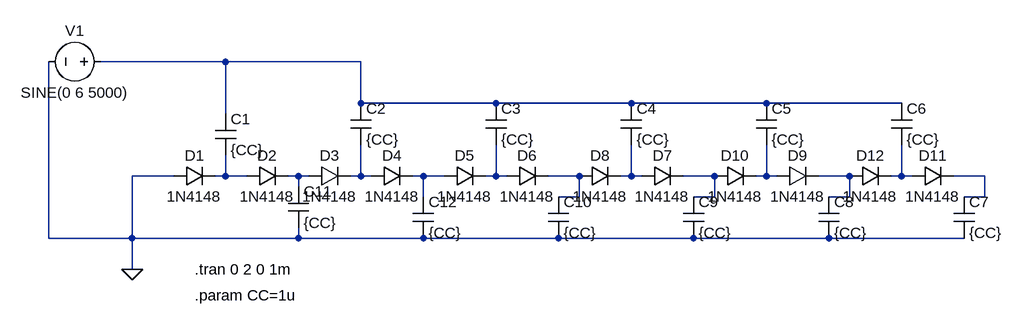
[diagram p0: schematic voltage-multiplier.asc]
voltage-multiplier.asc, the LTspice schematic file:
Version 4
SHEET 1 2364 1048
WIRE 160 80 -32 80
WIRE 368 80 160 80
WIRE 368 144 368 80
WIRE 576 144 368 144
WIRE 784 144 576 144
WIRE 992 144 784 144
WIRE 1200 144 992 144
WIRE 160 160 160 80
WIRE 80 256 16 256
WIRE 160 256 160 224
WIRE 160 256 144 256
WIRE 192 256 160 256
WIRE 272 256 256 256
WIRE 288 256 272 256
WIRE 368 256 368 208
WIRE 368 256 352 256
WIRE 384 256 368 256
WIRE 464 256 448 256
WIRE 496 256 464 256
WIRE 576 256 576 208
WIRE 576 256 560 256
WIRE 592 256 576 256
WIRE 704 256 656 256
WIRE 784 256 784 208
WIRE 784 256 768 256
WIRE 800 256 784 256
WIRE 912 256 864 256
WIRE 992 256 992 208
WIRE 992 256 976 256
WIRE 1008 256 992 256
WIRE 1120 256 1072 256
WIRE 1200 256 1200 208
WIRE 1200 256 1184 256
WIRE 1216 256 1200 256
WIRE 1328 256 1280 256
WIRE 272 272 272 256
WIRE 464 288 464 256
WIRE 704 288 704 256
WIRE 704 288 672 288
WIRE 912 288 912 256
WIRE 912 288 880 288
WIRE 1120 288 1120 256
WIRE 1120 288 1088 288
WIRE 1328 288 1328 256
WIRE 1328 288 1296 288
WIRE -112 352 -112 80
WIRE 16 352 16 256
WIRE 16 352 -112 352
WIRE 272 352 272 336
WIRE 272 352 16 352
WIRE 464 352 272 352
WIRE 672 352 464 352
WIRE 880 352 672 352
WIRE 1088 352 880 352
WIRE 1296 352 1088 352
WIRE 16 400 16 352
FLAG 16 400 0
SYMBOL diode 80 272 R270
WINDOW 0 32 32 VTop 2
WINDOW 3 0 32 VBottom 2
SYMATTR InstName D1
SYMATTR Value 1N4148
SYMBOL cap 144 160 R0
SYMATTR InstName C1
SYMATTR Value {CC}
SYMATTR SpiceLine V=X Rser=1m Lser=0 mfg="   ---" pn="   ---" type="   ---"
SYMBOL Voltage -16 80 R90
WINDOW 0 -32 56 VBottom 2
WINDOW 3 32 56 VTop 2
SYMATTR InstName V1
SYMATTR Value SINE(0 6 5000)
SYMATTR Value2 AC 0
SYMATTR SpiceLine Rser=50
SYMBOL diode 192 272 R270
WINDOW 0 32 32 VTop 2
WINDOW 3 0 32 VBottom 2
SYMATTR InstName D2
SYMATTR Value 1N4148
SYMBOL diode 288 272 R270
WINDOW 0 32 32 VTop 2
WINDOW 3 0 32 VBottom 2
SYMATTR InstName D3
SYMATTR Value 1N4148
SYMBOL diode 384 272 R270
WINDOW 0 32 32 VTop 2
WINDOW 3 0 32 VBottom 2
SYMATTR InstName D4
SYMATTR Value 1N4148
SYMBOL diode 592 272 R270
WINDOW 0 32 32 VTop 2
WINDOW 3 0 32 VBottom 2
SYMATTR InstName D6
SYMATTR Value 1N4148
SYMBOL diode 496 272 R270
WINDOW 0 32 32 VTop 2
WINDOW 3 0 32 VBottom 2
SYMATTR InstName D5
SYMATTR Value 1N4148
SYMBOL diode 800 272 R270
WINDOW 0 32 32 VTop 2
WINDOW 3 0 32 VBottom 2
SYMATTR InstName D7
SYMATTR Value 1N4148
SYMBOL diode 704 272 R270
WINDOW 0 32 32 VTop 2
WINDOW 3 0 32 VBottom 2
SYMATTR InstName D8
SYMATTR Value 1N4148
SYMBOL diode 1008 272 R270
WINDOW 0 32 32 VTop 2
WINDOW 3 0 32 VBottom 2
SYMATTR InstName D9
SYMATTR Value 1N4148
SYMBOL diode 912 272 R270
WINDOW 0 32 32 VTop 2
WINDOW 3 0 32 VBottom 2
SYMATTR InstName D10
SYMATTR Value 1N4148
SYMBOL diode 1216 272 R270
WINDOW 0 32 32 VTop 2
WINDOW 3 0 32 VBottom 2
SYMATTR InstName D11
SYMATTR Value 1N4148
SYMBOL diode 1120 272 R270
WINDOW 0 32 32 VTop 2
WINDOW 3 0 32 VBottom 2
SYMATTR InstName D12
SYMATTR Value 1N4148
SYMBOL cap 352 144 R0
SYMATTR InstName C2
SYMATTR Value {CC}
SYMATTR SpiceLine V=X Rser=1m Lser=0 mfg="   ---" pn="   ---" type="   ---"
SYMBOL cap 560 144 R0
SYMATTR InstName C3
SYMATTR Value {CC}
SYMATTR SpiceLine V=X Rser=1m Lser=0 mfg="   ---" pn="   ---" type="   ---"
SYMBOL cap 768 144 R0
SYMATTR InstName C4
SYMATTR Value {CC}
SYMATTR SpiceLine V=X Rser=1m Lser=0 mfg="   ---" pn="   ---" type="   ---"
SYMBOL cap 976 144 R0
SYMATTR InstName C5
SYMATTR Value {CC}
SYMATTR SpiceLine V=X Rser=1m Lser=0 mfg="   ---" pn="   ---" type="   ---"
SYMBOL cap 1184 144 R0
SYMATTR InstName C6
SYMATTR Value {CC}
SYMATTR SpiceLine V=X Rser=1m Lser=0 mfg="   ---" pn="   ---" type="   ---"
SYMBOL cap 1280 288 R0
SYMATTR InstName C7
SYMATTR Value {CC}
SYMATTR SpiceLine V=X Rser=1m Lser=0 mfg="   ---" pn="   ---" type="   ---"
SYMBOL cap 1072 288 R0
SYMATTR InstName C8
SYMATTR Value {CC}
SYMATTR SpiceLine V=X Rser=1m Lser=0 mfg="   ---" pn="   ---" type="   ---"
SYMBOL cap 864 288 R0
SYMATTR InstName C9
SYMATTR Value {CC}
SYMATTR SpiceLine V=X Rser=1m Lser=0 mfg="   ---" pn="   ---" type="   ---"
SYMBOL cap 656 288 R0
SYMATTR InstName C10
SYMATTR Value {CC}
SYMATTR SpiceLine V=X Rser=1m Lser=0 mfg="   ---" pn="   ---" type="   ---"
SYMBOL cap 256 272 R0
SYMATTR InstName C11
SYMATTR Value {CC}
SYMATTR SpiceLine V=X Rser=1m Lser=0 mfg="   ---" pn="   ---" type="   ---"
SYMBOL cap 448 288 R0
SYMATTR InstName C12
SYMATTR Value {CC}
SYMATTR SpiceLine V=X Rser=1m Lser=0 mfg="   ---" pn="   ---" type="   ---"
TEXT 112 400 Left 2 !.tran 0 2 0 1m
TEXT 112 440 Left 2 !.param CC=1u

The netlist it stands for:
* voltage-multiplier.asc
D1 0 N002 1N4148
C1 N001 N002 {CC} V=X Rser=1m Lser=0 mfg="   ---" pn="   ---" type="   ---"
V1 N001 0 SINE(0 6 5000) AC 0 Rser=50
D2 N002 N003 1N4148
D3 N003 N004 1N4148
D4 N004 N005 1N4148
D6 N006 N007 1N4148
D5 N005 N006 1N4148
D7 N008 N009 1N4148
D8 N007 N008 1N4148
D9 N010 N011 1N4148
D10 N009 N010 1N4148
D11 N012 N013 1N4148
D12 N011 N012 1N4148
C2 N001 N004 {CC} V=X Rser=1m Lser=0 mfg="   ---" pn="   ---" type="   ---"
C3 N001 N006 {CC} V=X Rser=1m Lser=0 mfg="   ---" pn="   ---" type="   ---"
C4 N001 N008 {CC} V=X Rser=1m Lser=0 mfg="   ---" pn="   ---" type="   ---"
C5 N001 N010 {CC} V=X Rser=1m Lser=0 mfg="   ---" pn="   ---" type="   ---"
C6 N001 N012 {CC} V=X Rser=1m Lser=0 mfg="   ---" pn="   ---" type="   ---"
C7 N013 0 {CC} V=X Rser=1m Lser=0 mfg="   ---" pn="   ---" type="   ---"
C8 N011 0 {CC} V=X Rser=1m Lser=0 mfg="   ---" pn="   ---" type="   ---"
C9 N009 0 {CC} V=X Rser=1m Lser=0 mfg="   ---" pn="   ---" type="   ---"
C10 N007 0 {CC} V=X Rser=1m Lser=0 mfg="   ---" pn="   ---" type="   ---"
C11 N003 0 {CC} V=X Rser=1m Lser=0 mfg="   ---" pn="   ---" type="   ---"
C12 N005 0 {CC} V=X Rser=1m Lser=0 mfg="   ---" pn="   ---" type="   ---"
.model D D
.lib standard.dio
.tran 0 2 0 1m
.param CC=1u
.backanno
.end